# Altium schematic sheet GateDrivers.SchDoc
size C; SheetNumber: 2; SheetTotal: 4
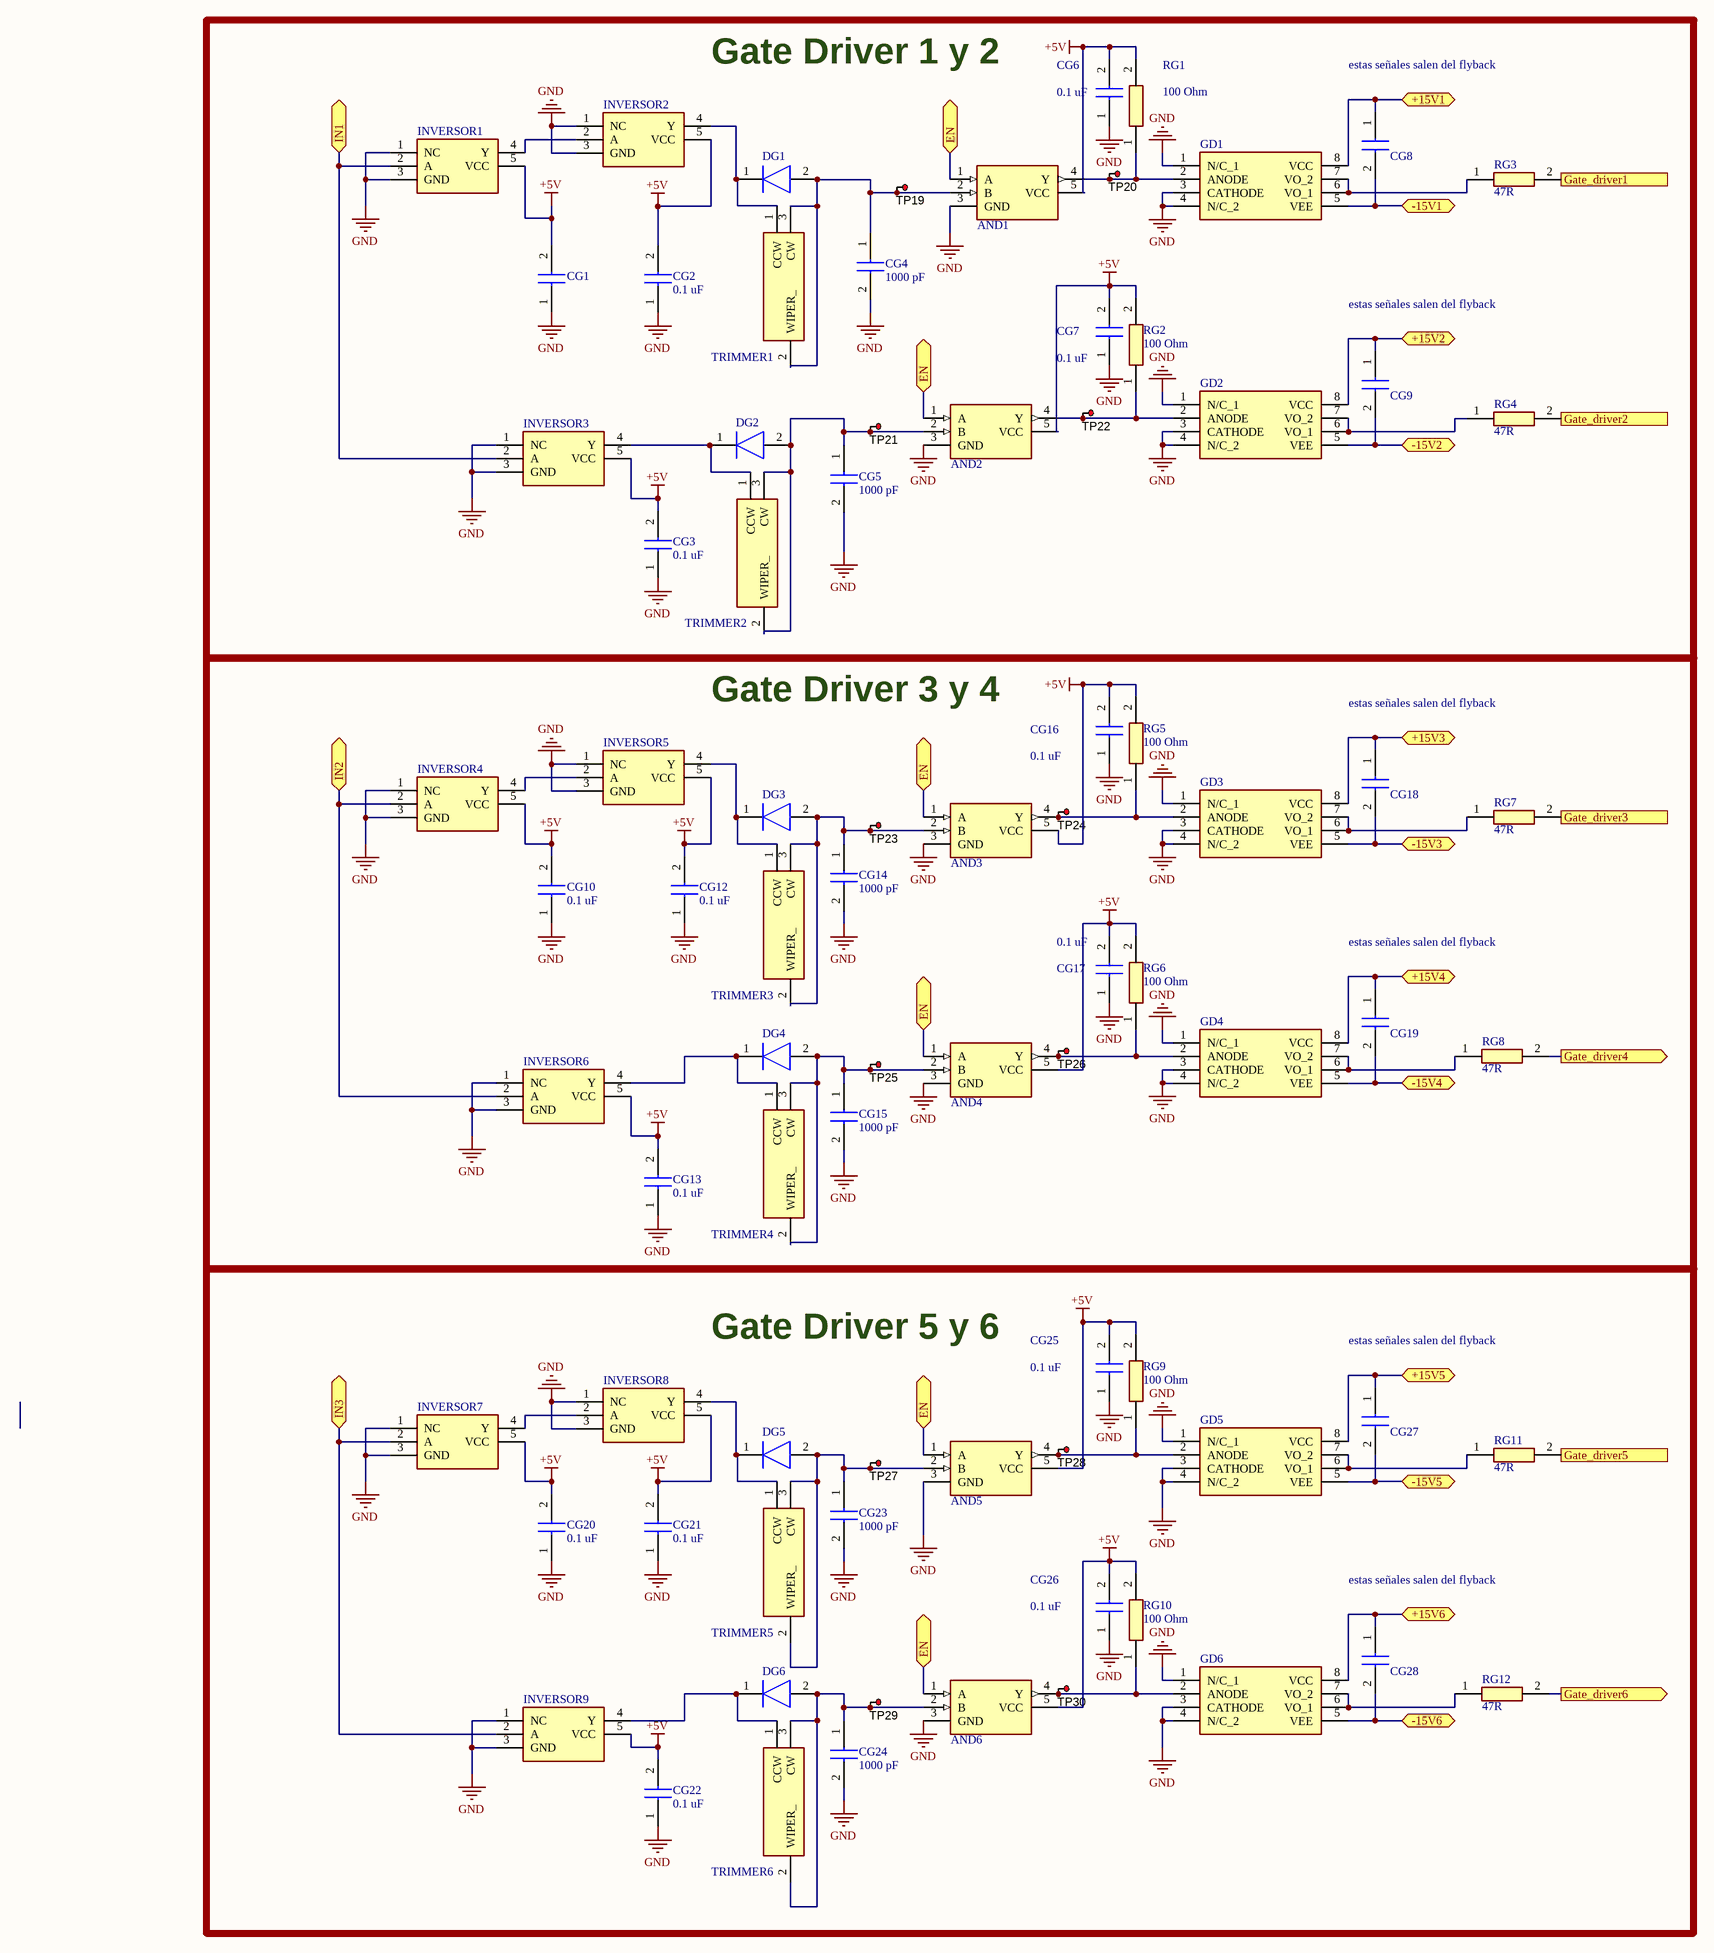
[diagram p0: GateDrivers.SchDoc]

## Parts
AND1  SN74AHC1G09DCKR  [SOT65P210X110-5N]  (value not drawn)
AND2  SN74AHC1G09DCKR  [SOT65P210X110-5N]  (value not drawn)
AND3  SN74AHC1G09DCKR  [SOT65P210X110-5N]  (value not drawn)
AND4  SN74AHC1G09DCKR  [SOT65P210X110-5N]  (value not drawn)
AND5  SN74AHC1G09DCKR  [SOT65P210X110-5N]  (value not drawn)
AND6  SN74AHC1G09DCKR  [SOT65P210X110-5N]  (value not drawn)
CG1  (no value)  [CAPC2012X94N]
CG2  0.1 uF  [CAPC2012X94N]
CG3  0.1 uF  [CAPC2012X94N]
CG4  1000 pF  [CAPC2012X98N]
CG5  1000 pF  [CAPC2012X98N]
CG6  0.1 uF  [CAPC2012X94N]
CG7  0.1 uF  [CAPC2012X94N]
CG8  CGA2B3X7R1V104M050BB_1  [CAPC1005X55N]  (value not drawn)
CG9  CGA2B3X7R1V104M050BB_1  [CAPC1005X55N]  (value not drawn)
CG10  0.1 uF  [CAPC2012X94N]
CG12  0.1 uF  [CAPC2012X94N]
CG13  0.1 uF  [CAPC2012X94N]
CG14  1000 pF  [CAPC2012X98N]
CG15  1000 pF  [CAPC2012X98N]
CG16  0.1 uF  [CAPC2012X94N]
CG17  0.1 uF  [CAPC2012X94N]
CG18  CGA2B3X7R1V104M050BB_1  [CAPC1005X55N]  (value not drawn)
CG19  CGA2B3X7R1V104M050BB_1  [CAPC1005X55N]  (value not drawn)
CG20  0.1 uF  [CAPC2012X94N]
CG21  0.1 uF  [CAPC2012X94N]
CG22  0.1 uF  [CAPC2012X94N]
CG23  1000 pF  [CAPC2012X98N]
CG24  1000 pF  [CAPC2012X98N]
CG25  0.1 uF  [CAPC2012X94N]
CG26  0.1 uF  [CAPC2012X94N]
CG27  CGA2B3X7R1V104M050BB_1  [CAPC1005X55N]  (value not drawn)
CG28  CGA2B3X7R1V104M050BB_1  [CAPC1005X55N]  (value not drawn)
DG1  BAS85-GS08  [BAQ33GS08]  (value not drawn)
DG2  BAS85-GS08  [BAQ33GS08]  (value not drawn)
DG3  BAS85-GS08  [BAQ33GS08]  (value not drawn)
DG4  BAS85-GS08  [BAQ33GS08]  (value not drawn)
DG5  BAS85-GS08  [BAQ33GS08]  (value not drawn)
DG6  BAS85-GS08  [BAQ33GS08]  (value not drawn)
GD1  HCPL-3120  [DIP762W65P254L965H470Q8N]  (value not drawn)
GD2  HCPL-3120  [DIP762W65P254L965H470Q8N]  (value not drawn)
GD3  HCPL-3120  [DIP762W65P254L965H470Q8N]  (value not drawn)
GD4  HCPL-3120  [DIP762W65P254L965H470Q8N]  (value not drawn)
GD5  HCPL-3120  [DIP762W65P254L965H470Q8N]  (value not drawn)
GD6  HCPL-3120  [DIP762W65P254L965H470Q8N]  (value not drawn)
INVERSOR1  SN74AHC1G14DRLR  [SOTFL50P160X60-5N]  (value not drawn)
INVERSOR2  SN74AHC1G14DRLR  [SOTFL50P160X60-5N]  (value not drawn)
INVERSOR3  SN74AHC1G14DRLR  [SOTFL50P160X60-5N]  (value not drawn)
INVERSOR4  SN74AHC1G14DRLR  [SOTFL50P160X60-5N]  (value not drawn)
INVERSOR5  SN74AHC1G14DRLR  [SOTFL50P160X60-5N]  (value not drawn)
INVERSOR6  SN74AHC1G14DRLR  [SOTFL50P160X60-5N]  (value not drawn)
INVERSOR7  SN74AHC1G14DRLR  [SOTFL50P160X60-5N]  (value not drawn)
INVERSOR8  SN74AHC1G14DRLR  [SOTFL50P160X60-5N]  (value not drawn)
INVERSOR9  SN74AHC1G14DRLR  [SOTFL50P160X60-5N]  (value not drawn)
RG1  100 Ohm  [RESC1608X55N]
RG2  100 Ohm  [RESC1608X55N]
RG3  Resistance: 47R  [RESC3246X60N]  (hidden comment: RCL121847R0JNEK_1)
RG4  Resistance: 47R  [RESC3246X60N]  (hidden comment: RCL121847R0JNEK_1)
RG5  100 Ohm  [RESC1608X55N]
RG6  100 Ohm  [RESC1608X55N]
RG7  Resistance: 47R  [RESC3246X60N]  (hidden comment: RCL121847R0JNEK_1)
RG8  Resistance: 47R  [RESC3246X60N]  (hidden comment: RCL121847R0JNEK_1)
RG9  100 Ohm  [RESC1608X55N]
RG10  100 Ohm  [RESC1608X55N]
RG11  Resistance: 47R  [RESC3246X60N]  (hidden comment: RCL121847R0JNEK_1)
RG12  Resistance: 47R  [RESC3246X60N]  (hidden comment: RCL121847R0JNEK_1)
TP19  5010  [Keystone5010]  (value not drawn)
TP20  5010  [Keystone5010]  (value not drawn)
TP21  5010  [Keystone5010]  (value not drawn)
TP22  5010  [Keystone5010]  (value not drawn)
TP23  5010  [Keystone5010]  (value not drawn)
TP24  5010  [Keystone5010]  (value not drawn)
TP25  5010  [Keystone5010]  (value not drawn)
TP26  5010  [Keystone5010]  (value not drawn)
TP27  5010  [Keystone5010]  (value not drawn)
TP28  5010  [Keystone5010]  (value not drawn)
TP29  5010  [Keystone5010]  (value not drawn)
TP30  5010  [Keystone5010]  (value not drawn)
TRIMMER1  ST-4ETB203  [ST4ETB203]  (value not drawn)
TRIMMER2  ST-4ETB203  [ST4ETB203]  (value not drawn)
TRIMMER3  ST-4ETB203  [ST4ETB203]  (value not drawn)
TRIMMER4  ST-4ETB203  [ST4ETB203]  (value not drawn)
TRIMMER5  ST-4ETB203  [ST4ETB203]  (value not drawn)
TRIMMER6  ST-4ETB203  [ST4ETB203]  (value not drawn)

## Blocks framed on the sheet
Gate Driver 1 y 2: AND1 AND2 CG1-CG9 DG1 DG2 GD1 GD2 INVERSOR1-INVERSOR3 RG1-RG4 TP19-TP22 TRIMMER1 TRIMMER2
Gate Driver 3 y 4: AND3 AND4 CG10 CG12-CG19 DG3 DG4 GD3 GD4 INVERSOR4-INVERSOR6 RG5-RG8 TP23-TP26 TRIMMER3 TRIMMER4
Gate Driver 5 y 6: AND5 AND6 CG20-CG28 DG5 DG6 GD5 GD6 INVERSOR7-INVERSOR9 RG9-RG12 TP27-TP30 TRIMMER5 TRIMMER6

## Ports
+15V1 (bidir), +15V2 (bidir), +15V3 (bidir), +15V4 (bidir), +15V5 (bidir), +15V6 (bidir), -15V1 (bidir), -15V2 (bidir), -15V3 (bidir), -15V4 (bidir), -15V5 (bidir), -15V6 (bidir), EN (bidir), Gate_driver1 (out), Gate_driver2 (out), Gate_driver3 (out), Gate_driver4 (out), Gate_driver5 (out), Gate_driver6 (out), IN1 (bidir), IN2 (bidir), IN3 (bidir)

## Nets
+5V: AND1.5(VCC) AND2.5(VCC) AND3.5(VCC) AND4.5(VCC) AND5.5(VCC) AND6.5(VCC) CG1.2 CG2.2 CG3.2 CG6.2 CG7.2 CG10.2 CG12.2 CG13.2 CG16.2 CG17.2 CG20.2 CG21.2 CG22.2 CG25.2 CG26.2 INVERSOR1.5(VCC) INVERSOR2.5(VCC) INVERSOR3.5(VCC) INVERSOR4.5(VCC) INVERSOR5.5(VCC) INVERSOR6.5(VCC) INVERSOR7.5(VCC) INVERSOR8.5(VCC) INVERSOR9.5(VCC) RG1.2 RG2.2 RG5.2 RG6.2 RG9.2 RG10.2
GND: AND1.3(GND) AND2.3(GND) AND3.3(GND) AND4.3(GND) AND5.3(GND) AND6.3(GND) CG1.1 CG2.1 CG3.1 CG4.2 CG5.2 CG6.1 CG7.1 CG10.1 CG12.1 CG13.1 CG14.2 CG15.2 CG16.1 CG17.1 CG20.1 CG21.1 CG22.1 CG23.2 CG24.2 CG25.1 CG26.1 GD1.1(N/C_1) GD1.3(CATHODE) GD1.4(N/C_2) GD2.1(N/C_1) GD2.3(CATHODE) GD2.4(N/C_2) GD3.1(N/C_1) GD3.3(CATHODE) GD3.4(N/C_2) GD4.1(N/C_1) GD4.3(CATHODE) GD4.4(N/C_2) GD5.1(N/C_1) GD5.3(CATHODE) GD5.4(N/C_2) GD6.1(N/C_1) GD6.3(CATHODE) GD6.4(N/C_2) INVERSOR1.1(NC) INVERSOR1.3(GND) INVERSOR2.1(NC) INVERSOR2.3(GND) INVERSOR3.1(NC) INVERSOR3.3(GND) INVERSOR4.1(NC) INVERSOR4.3(GND) INVERSOR5.1(NC) INVERSOR5.3(GND) INVERSOR6.1(NC) INVERSOR6.3(GND) INVERSOR7.1(NC) INVERSOR7.3(GND) INVERSOR8.1(NC) INVERSOR8.3(GND) INVERSOR9.1(NC) INVERSOR9.3(GND)
+15V1: CG8.1 GD1.8(VCC) ; port +15V1
+15V2: CG9.1 GD2.8(VCC) ; port +15V2
+15V3: CG18.1 GD3.8(VCC) ; port +15V3
+15V4: CG19.1 GD4.8(VCC) ; port +15V4
+15V5: CG27.1 GD5.8(VCC) ; port +15V5
+15V6: CG28.1 GD6.8(VCC) ; port +15V6
-15V1: CG8.2 GD1.5(VEE) ; port -15V1
-15V2: CG9.2 GD2.5(VEE) ; port -15V2
-15V3: CG18.2 GD3.5(VEE) ; port -15V3
-15V4: CG19.2 GD4.5(VEE) ; port -15V4
-15V5: CG27.2 GD5.5(VEE) ; port -15V5
-15V6: CG28.2 GD6.5(VEE) ; port -15V6
EN: AND1.1(A) AND2.1(A) AND3.1(A) AND4.1(A) AND5.1(A) AND6.1(A) ; port EN
Gate_driver1: RG3.2 ; port Gate_driver1
Gate_driver2: RG4.2 ; port Gate_driver2
Gate_driver3: RG7.2 ; port Gate_driver3
Gate_driver4: RG8.2 ; port Gate_driver4
Gate_driver5: RG11.2 ; port Gate_driver5
Gate_driver6: RG12.2 ; port Gate_driver6
IN1: INVERSOR1.2(A) INVERSOR3.2(A) ; port IN1
IN2: INVERSOR4.2(A) INVERSOR6.2(A) ; port IN2
IN3: INVERSOR7.2(A) INVERSOR9.2(A) ; port IN3
NetAND1_2: AND1.2(B) CG4.1 DG1.2(A) TP19.1 TRIMMER1.2(WIPER_) TRIMMER1.3(CW)
NetAND1_4: AND1.4(Y) GD1.2(ANODE) RG1.1 TP20.1
NetAND2_2: AND2.2(B) CG5.1 DG2.2(A) TP21.1 TRIMMER2.2(WIPER_) TRIMMER2.3(CW)
NetAND2_4: AND2.4(Y) GD2.2(ANODE) RG2.1 TP22.1
NetAND3_2: AND3.2(B) CG14.1 DG3.2(A) TP23.1 TRIMMER3.2(WIPER_) TRIMMER3.3(CW)
NetAND3_4: AND3.4(Y) GD3.2(ANODE) RG5.1 TP24.1
NetAND4_2: AND4.2(B) CG15.1 DG4.2(A) TP25.1 TRIMMER4.2(WIPER_) TRIMMER4.3(CW)
NetAND4_4: AND4.4(Y) GD4.2(ANODE) RG6.1 TP26.1
NetAND5_2: AND5.2(B) CG23.1 DG5.2(A) TP27.1 TRIMMER5.2(WIPER_) TRIMMER5.3(CW)
NetAND5_4: AND5.4(Y) GD5.2(ANODE) RG9.1 TP28.1
NetAND6_2: AND6.2(B) CG24.1 DG6.2(A) TP29.1 TRIMMER6.2(WIPER_) TRIMMER6.3(CW)
NetAND6_4: AND6.4(Y) GD6.2(ANODE) RG10.1 TP30.1
NetDG1_1: DG1.1(K) INVERSOR2.4(Y) TRIMMER1.1(CCW)
NetDG2_1: DG2.1(K) INVERSOR3.4(Y) TRIMMER2.1(CCW)
NetDG3_1: DG3.1(K) INVERSOR5.4(Y) TRIMMER3.1(CCW)
NetDG4_1: DG4.1(K) INVERSOR6.4(Y) TRIMMER4.1(CCW)
NetDG5_1: DG5.1(K) INVERSOR8.4(Y) TRIMMER5.1(CCW)
NetDG6_1: DG6.1(K) INVERSOR9.4(Y) TRIMMER6.1(CCW)
NetGD1_6: GD1.6(VO_1) GD1.7(VO_2) RG3.1
NetGD2_6: GD2.6(VO_1) GD2.7(VO_2) RG4.1
NetGD3_6: GD3.6(VO_1) GD3.7(VO_2) RG7.1
NetGD4_6: GD4.6(VO_1) GD4.7(VO_2) RG8.1
NetGD5_6: GD5.6(VO_1) GD5.7(VO_2) RG11.1
NetGD6_6: GD6.6(VO_1) GD6.7(VO_2) RG12.1
NetINVERSOR1_4: INVERSOR1.4(Y) INVERSOR2.2(A)
NetINVERSOR4_4: INVERSOR4.4(Y) INVERSOR5.2(A)
NetINVERSOR7_4: INVERSOR7.4(Y) INVERSOR8.2(A)

## Notes on the sheet
- estas señales salen del flyback

## Library data of the parts
AND1-AND6 = SN74AHC1G09DCKR: TEXAS INSTRUMENTS         SN74AHC1G09DCKR             AND Gate, ACH Family, 2 Input, 1 Gate, 25 mA, 2V to 5.5V, SC-70-5; Quiescent Current: 1uA; Output Current: 25mA; Number of Inputs: 2; Propagation Delay: 7.5ns; Number of Outputs: 1; Low Level Output Current: 8mA; Datasheet Link: http://www.ti.com/lit/gpn/sn74ahc1g09; Height: 1.1mm; Manufacturer_Name: Texas Instruments; Manufacturer_Part_Number: SN74AHC1G09DCKR; Supplier 1: Digi-Key; Manufacturer: Texas Instruments; Manufacturer Part Number: SN74AHC1G09DCKR; RoHS: Yes; Category: Logic Gates; Stock 1: 19244; Pricing 1: 1=0.40000, 10=0.29700, 25=0.25960, 100=0.16810, 250=0.13912, 500=0.11130, 1000=0.08533 (USD); Mount: Surface Mount; Case/Package: SC; Number of Pins: 5; Min Operating Temperature: -55°C; Max Operating Temperature: 125°C; Max Supply Voltage: 5.5V; Min Supply Voltage: 2V; Logic Function: AND GATE; Packaging: Tape and Reel; Package Quantity: 3000; Output Voltage: 5.5V; Number of Circuits: 1; Number of Gates: 1; Number of Elements: 1; Number of Bits: 1; Series: 74AHC; Technology: CMOS; Radiation Hardening: No; REACH SVHC: No SVHC; Lead Free: Lead Free; RoHS Compliant: Yes; ComponentLink1URL: https://datasheet.ciiva.com/1869/sn74ahc1g09-1869442.pdf?src-supplier=Digi-Key; ComponentLink1Description: https://datasheet.ciiva.com/1869/sn74ahc1g09-1869442.pdf?src-supplier=Digi-Key; ComponentLink2URL: https://datasheet.ciiva.com/4817/scls724b-115396-4817364.pdf?src-supplier=Mouser; ComponentLink2Description: https://datasheet.ciiva.com/4817/scls724b-115396-4817364.pdf?src-supplier=Mouser; ComponentLink3URL: https://datasheet.ciiva.com/1869/sn74ahc1g09-1869443.pdf?src-supplier=Digi-Key; ComponentLink3Description: https://datasheet.ciiva.com/1869/sn74ahc1g09-1869443.pdf?src-supplier=Digi-Key; ComponentLink4URL: https://datasheet.ciiva.com/1869/sn74ahc1g09-1869444.pdf?src-supplier=Digi-Key; ComponentLink4Description: https://datasheet.ciiva.com/1869/sn74ahc1g09-1869444.pdf?src-supplier=Digi-Key; ComponentLink5URL: https://datasheet.ciiva.com/14310/sn74ahc1g09-14310535.pdf?src-supplier=Avnet; ComponentLink5Description: https://datasheet.ciiva.com/14310/sn74ahc1g09-14310535.pdf?src-supplier=Avnet; ComponentLink6URL: https://datasheet.ciiva.com/41677/1864448-41677365.pdf?src-supplier=Newark; ComponentLink6Description: https://datasheet.ciiva.com/41677/1864448-41677365.pdf?src-supplier=Newark; Supplier Part Number 1: 296-29203-1-ND
CG1-CG3 CG6 CG7 CG10 CG12 CG13 CG16 CG17 CG20-CG22 CG25 CG26 = 0805YC104KAT2A: Multilayer Ceramic Capacitors MLCC - SMD/SMT 16V .1uF X7R 0805 10%; Manufacturer_Name: AVX; Manufacturer: Kyocera AVX; Capacitance: 100nF; Dissipation Factor: 12.5%; Insulation Resistance: 100GR; Datasheet Link: https://spicat.avx.com/product/mlcc/chartview/0805YC104KAT2A/DataSheet/X7R; Height: 0.94mm; Manufacturer_Part_Number: 0805YC104KAT2A; Mouser Part Number: 581-0805YC104K; Mouser Price/Stock: https://www.mouser.co.uk/ProductDetail/AVX/0805YC104KAT2A?qs=0j3vzYx9OgS3bRufCc82qg%3D%3D; Arrow Part Number: 0805YC104KAT2A; Arrow Price/Stock: https://www.arrow.com/en/products/0805yc104kat2a/avx; Supplier 1: Digi-Key; Manufacturer Part Number: 0805YC104KAT2A; RoHS: Yes; Category: Ceramic Capacitors; Stock 1: 61419; Pricing 1: 1=0.30000, 10=0.20700, 50=0.12420, 100=0.10490, 500=0.07176, 1000=0.06348 (USD); Mount: Surface Mount; Case/Package: 0805; Number of Pins: 2; Case Code (Metric): 2012; Case Code (Imperial): 0805; Min Operating Temperature: -55°C; Max Operating Temperature: 125°C; Tolerance: 10%; Dielectric: X7R; Packaging: Tape and Reel; Voltage Rating: 16V; Package Quantity: 1; Termination: SMD/SMT; Voltage Rating (DC): 16V; Series: -; Construction: Flat; Length: 2.01mm; Width: 0.049inch; Depth: 1.25mm; Thickness: 0.037inch; Radiation Hardening: No; REACH SVHC: No SVHC; Lead Free: Lead Free; RoHS Compliant: Yes; ComponentLink1URL: https://datasheet.ciiva.com/206/cx7r-206011.pdf?src-supplier=Digi-Key; ComponentLink1Description: https://datasheet.ciiva.com/206/cx7r-206011.pdf?src-supplier=Digi-Key; ComponentLink2URL: https://datasheet.ciiva.com/5418/cx7r-5418479.pdf?src-supplier=Mouser; ComponentLink2Description: https://datasheet.ciiva.com/5418/cx7r-5418479.pdf?src-supplier=Mouser; ComponentLink3URL: https://datasheet.ciiva.com/2988/cx7r-2988050.pdf?src-supplier=Avnet; ComponentLink3Description: https://datasheet.ciiva.com/2988/cx7r-2988050.pdf?src-supplier=Avnet; ComponentLink4URL: https://datasheet.ciiva.com/14906/cx7r-14906278.pdf?src-supplier=Digi-Key; ComponentLink4Description: https://datasheet.ciiva.com/14906/cx7r-14906278.pdf?src-supplier=Digi-Key; ComponentLink5URL: https://datasheet.ciiva.com/15212/getdatasheetpartid-150472-15212621.pdf?src-supplier=Verical; ComponentLink5Description: https://datasheet.ciiva.com/15212/getdatasheetpartid-150472-15212621.pdf?src-supplier=Verical; ComponentLink6URL: https://datasheet.ciiva.com/28613/1679506-28613143.pdf?src-supplier=Element14; ComponentLink6Description: https://datasheet.ciiva.com/28613/1679506-28613143.pdf?src-supplier=Element14; ComponentLink7URL: https://datasheet.ciiva.com/16623/cx7r-16623414.pdf?src-supplier=Avnet+Europe; ComponentLink7Description: https://datasheet.ciiva.com/16623/cx7r-16623414.pdf?src-supplier=Avnet+Europe; Supplier Part Number 1: 478-7961-1-ND
CG4 CG5 CG14 CG15 CG23 CG24 = C0805Y102K3RACTU: Multilayer Ceramic Capacitors MLCC - SMD/SMT 25volts 1000pF 10% X7R; Manufacturer_Name: Kemet; Capacitance: 1nF; Voltage Rating (DC): 25V; Datasheet Link: https://www.kemet.com/specsheet/C0805Y102K3RACTU; Height: 0.98mm; Manufacturer_Part_Number: C0805Y102K3RACTU; Mouser Part Number: 80-C0805Y102K3R; Mouser Price/Stock: https://www.mouser.com/Search/Refine.aspx?Keyword=80-C0805Y102K3R; Manufacturer: KEMET; Manufacturer Part Number: C0805Y102K3RACTU; RoHS: Yes; Category: Capacitors; Stock 1: 8015; Pricing 1: 1=0.43000, 10=0.30100, 50=0.30100, 100=0.18100, 1000=0.11400, 10000=0.10200 (USD); Case/Package: 0805; Case Code (Imperial): 0805; Case Code (Metric): 2012; Weight: 0.000194oz; Dielectric Material: Ceramic; Min Operating Temperature: -55°C; Max Operating Temperature: 125°C; Packaging: Tape and Reel; Tolerance: 10%; Dielectric: X7R; Termination: SMD/SMT; Series: C0805Y; RoHS Compliant: Yes; ComponentLink1URL: http://www.mouser.com/ds/2/212/KEM_C1015_X7R_FF-CAP_SMD-1101148.pdf?src-supplier=Mouser; ComponentLink1Description: http://www.mouser.com/ds/2/212/KEM_C1015_X7R_FF-CAP_SMD-1101148.pdf?src-supplier=Mouser
  CG4 CG14 CG23: Supplier 1: Digi-Key; Supplier Part Number 1: 399-15433-1-ND
  CG5 CG15 CG24: Supplier 1: Mouser; Supplier Part Number 1: 80-C0805Y102K3R
CG8 CG9 CG18 CG19 CG27 CG28 = CGA2B3X7R1V104M050BB_1: Cap Ceramic 0.1uF 35V X7R 20% Pad SMD 0402 125C Automotive T/R; Manufacturer_Name: TDK; Capacitance: 100nF; Height: 0.55mm; Manufacturer_Part_Number: CGA2B3X7R1V104M050BB; Supplier 1: Digi-Key; Manufacturer: TDK; Manufacturer Part Number: CGA2B3X7R1V104M050BB; RoHS: Yes; Category: Ceramic Capacitors; Stock 1: 93877; Pricing 1: 1=0.14000, 10=0.10200, 50=0.05780, 100=0.04780, 500=0.03356, 1000=0.02778, 2500=0.02585, 5000=0.02365 (USD); Mount: Surface Mount; Case/Package: 0402; Case Code (Metric): 1005; Case Code (Imperial): 0402; Min Operating Temperature: -55°C; Max Operating Temperature: 125°C; Tolerance: 20%; Dielectric: X7R; Packaging: Tape and Reel; Voltage Rating: 35V; Package Quantity: 10000; Voltage Rating (DC): 35V; Series: CGA; Length: 0.039inch; Width: 0.02inch; Thickness: 0.022inch; RoHS Compliant: Yes; ComponentLink1URL: http://www.mouser.com/ds/2/400/lcc_automotive_general_en-843974.pdf?src-supplier=Mouser; ComponentLink1Description: http://www.mouser.com/ds/2/400/lcc_automotive_general_en-843974.pdf?src-supplier=Mouser; ComponentLink2URL: https://product.tdk.com/info/en/catalog/datasheets/mlcc_automotive_general_en.pdf?src-supplier=Digi-Key; ComponentLink2Description: https://product.tdk.com/info/en/catalog/datasheets/mlcc_automotive_general_en.pdf?src-supplier=Digi-Key; ComponentLink3URL: https://product.tdk.com/info/en/documents/chara_sheet/CGA2B3X7R1V104M050BB.pdf?src-supplier=Digi-Key; ComponentLink3Description: https://product.tdk.com/info/en/documents/chara_sheet/CGA2B3X7R1V104M050BB.pdf?src-supplier=Digi-Key; ComponentLink4URL: http://product.tdk.com/en/catalog/datasheets/mlcc_automotive_general_en.pdf?src-supplier=Avnet; ComponentLink4Description: http://product.tdk.com/en/catalog/datasheets/mlcc_automotive_general_en.pdf?src-supplier=Avnet; Supplier Part Number 1: 445-12264-1-ND; Weight: 2.3E-05oz; Ratings: AEC-Q200
DG1-DG6 = BAS85-GS08: VISHAY - BAS85-GS08 - Small Signal Schottky Diode, Single, 30 V, 200 mA, 800 mV, 600 mA, 125 °C; Manufacturer: Vishay Semiconductors; Recovery Time: 5ns; Max Surge Current: 600mA; Forward Voltage: 800mV; Forward Current: 200mA; Max Reverse Current: 2uA; Max Repetitive Reverse Voltage (Vrrm): 30V; Power Dissipation: 200mW; Current Rating: 200A; Datasheet Link: https://www.vishay.com/docs/85510/bas85.pdf; Height: 1.6mm; Manufacturer_Name: Vishay; Manufacturer_Part_Number: BAS85-GS08; Supplier 1: Allied Electronics; Manufacturer Part Number: BAS85-GS08; RoHS: Yes; Category: Rectifier Diodes; Stock 1: 12500; Pricing 1: 1=0.06300, 12500=0.06000, 625000=0.05900 (USD); Mount: Surface Mount; Number of Pins: 2; Contact Plating: Tin,Silver; Min Operating Temperature: -55°C; Max Operating Temperature: 125°C; Package Quantity: 1; Packaging: Tape and Reel; Average Rectified Current: 200mA; Reverse Recovery Time: 5ns; Max Reverse Leakage Current: 2uA; Peak Non-Repetitive Surge Current: 600mA; Max Forward Surge Current (Ifsm): 600mA; Element Configuration: Single; Current: 200mA; Voltage: 30V; Max Reverse Voltage (DC): 30V; Diameter: 1.6mm; Length: 0.145inch; Width: 1.6mm; Radiation Hardening: No; REACH SVHC: Unknown; Lead Free: Lead Free; RoHS Compliant: Yes; ComponentLink1URL: https://datasheet.ciiva.com/1202/1354484-1202985.pdf?src-supplier=Farnell; ComponentLink1Description: https://datasheet.ciiva.com/1202/1354484-1202985.pdf?src-supplier=Farnell; ComponentLink2URL: https://datasheet.ciiva.com/4715/bas85-88986-4715157.pdf?src-supplier=Mouser; ComponentLink2Description: https://datasheet.ciiva.com/4715/bas85-88986-4715157.pdf?src-supplier=Mouser; ComponentLink3URL: https://datasheet.ciiva.com/17069/0900766b80de2cb8-17069417.pdf?src-supplier=Allied+Electronics; ComponentLink3Description: https://datasheet.ciiva.com/17069/0900766b80de2cb8-17069417.pdf?src-supplier=Allied+Electronics; ComponentLink4URL: https://datasheet.ciiva.com/1240/1749352-1240576.pdf?src-supplier=Newark; ComponentLink4Description: https://datasheet.ciiva.com/1240/1749352-1240576.pdf?src-supplier=Newark; ComponentLink5URL: https://datasheet.ciiva.com/13950/bas85-13950054.pdf?src-supplier=Digi-Key; ComponentLink5Description: https://datasheet.ciiva.com/13950/bas85-13950054.pdf?src-supplier=Digi-Key; ComponentLink6URL: https://datasheet.ciiva.com/13950/bas85-13950058.pdf?src-supplier=Digi-Key; ComponentLink6Description: https://datasheet.ciiva.com/13950/bas85-13950058.pdf?src-supplier=Digi-Key; ComponentLink7URL: https://datasheet.ciiva.com/8281/bas85-8281903.pdf?src-supplier=Avnet; ComponentLink7Description: https://datasheet.ciiva.com/8281/bas85-8281903.pdf?src-supplier=Avnet; ComponentLink8URL: https://datasheet.ciiva.com/16298/bas85-16298175.pdf?src-supplier=Future+Electronics; ComponentLink8Description: https://datasheet.ciiva.com/16298/bas85-16298175.pdf?src-supplier=Future+Electronics; ComponentLink9URL: https://datasheet.ciiva.com/16941/70061833-16941564.pdf?src-supplier=Allied+Electronics; ComponentLink9Description: https://datasheet.ciiva.com/16941/70061833-16941564.pdf?src-supplier=Allied+Electronics; ComponentLink10URL: https://datasheet.ciiva.com/25936/bas85-25936302.pdf?src-supplier=Avnet+Europe; ComponentLink10Description: https://datasheet.ciiva.com/25936/bas85-25936302.pdf?src-supplier=Avnet+Europe; Supplier Part Number 1: 70062025
GD1-GD6 = HCPL-3120: Optocoupler Drive Push-Pull 1-CH 30V 1500V 8-Pin PDIP; Manufacturer_Name: Avago Technologies; Manufacturer: Broadcom Avago; Number of Channels: 1; Propagation Delay: 500ns; Rise Time: 100ns; Pulse Width Distortion (PWD): 300ns; Direction: Unidirectional; Max Power Dissipation: 295mW; Forward Current: 25mA; Forward Voltage: 1.5V; Reverse Breakdown Voltage: 5V; High Level Output Current: 2A; Fall Time: 0.1us; Isolation Voltage: 3.75kV; Max Output Current: 2.5A; Input Type: DC; Approvals: CSA,UR; Datasheet Link: https://docs.broadcom.com/docs/AV02-0161EN; Height: 4.7mm; Mouser2 Part Number: 630-HCPL-3120; Mouser2 Price/Stock: https://www.mouser.com/Search/Refine.aspx?Keyword=630-HCPL-3120; Manufacturer_Part_Number: HCPL-3120; Supplier 1: Digi-Key; Manufacturer Part Number: HCPL-3120; RoHS: No; Category: Optocouplers; Stock 1: 3108; Pricing 1: 1=4.42000, 10=3.12300, 100=2.55790, 500=2.15642, 1000=2.10450 (USD); Mount: Through Hole; Case/Package: PDIP; Number of Pins: 8; Min Operating Temperature: -40°C; Max Operating Temperature: 100°C; Packaging: Rail/Tube; Package Quantity: 50; Series: -; Low Level Output Current: 2A; Turn-On Delay Time: 500ns; Number of Elements: 1; Power Dissipation: 295mW; Output Type: PUSH-PULL; Radiation Hardening: No; RoHS Compliant: No; Lead Free: Contains Lead; ComponentLink1URL: https://datasheet.ciiva.com/19453/1550434-19453924.pdf?src-supplier=Jameco; ComponentLink1Description: https://datasheet.ciiva.com/19453/1550434-19453924.pdf?src-supplier=Jameco; ComponentLink2URL: https://datasheet.ciiva.com/15119/getdatasheetpartid-141584-15119757.pdf?src-supplier=Verical; ComponentLink2Description: https://datasheet.ciiva.com/15119/getdatasheetpartid-141584-15119757.pdf?src-supplier=Verical; Supplier Part Number 1: 516-1121-5-ND
INVERSOR1-INVERSOR9 = SN74AHC1G14DRLR: IC INVERTER SCHMITT 1CH SOT5; Manufacturer_Name: Texas Instruments; Number of Inputs: 1; Propagation Delay: 10.6ns; Max Supply Voltage: 5.5V; Min Supply Voltage: 2V; Logic Function: Inverting,Schmitt Trigger,Inverter; Quiescent Current: 1uA; High Level Output Current: -8mA; Low Level Output Current: 8mA; Turn-On Delay Time: 18.5ns; Input Type: SCHMITT TRIGGER; Operating Supply Voltage: 5V; Datasheet Link: http://www.ti.com/lit/gpn/sn74ahc1g14; Height: 0.6mm; Mouser2 Part Number: 595-SN74AHC1G14DRLR; Mouser2 Price/Stock: https://www.mouser.com/Search/Refine.aspx?Keyword=595-SN74AHC1G14DRLR; Manufacturer_Part_Number: SN74AHC1G14DRLR; Supplier 1: Digi-Key; Manufacturer: Texas Instruments; Manufacturer Part Number: SN74AHC1G14DRLR; RoHS: Yes; Category: Logic Gates; Stock 1: 2029; Pricing 1: 1=0.51000, 10=0.41400, 25=0.37840, 100=0.28150, 250=0.25516, 500=0.21116, 1000=0.15836 (USD); Mount: Surface Mount; Case/Package: SOT-553; Number of Pins: 5; Weight: 9.9E-05oz; Min Operating Temperature: -40°C; Max Operating Temperature: 125°C; Package Quantity: 4000; Packaging: Cut Tape; Number of Elements: 1; Number of Circuits: 1; Number of Gates: 1; Number of Bits: 1; Series: SN74AHC1G14; Radiation Hardening: No; Lead Free: Lead Free; RoHS Compliant: Yes; ComponentLink1URL: https://datasheet.ciiva.com/1866/sn74ahc1g14-1866325.pdf?src-supplier=Digi-Key; ComponentLink1Description: https://datasheet.ciiva.com/1866/sn74ahc1g14-1866325.pdf?src-supplier=Digi-Key; Supplier Part Number 1: 296-23232-1-ND
RG1 RG2 RG5 RG6 RG9 RG10 = RC0603JR-13100RL: YAGEO - RC0603JR-13100RL - RES, THICK FILM, 100R, 5%, 0.1W, 0603; Manufacturer_Name: YAGEO (PHYCOMP); Resistance: 47; Power Rating: 100mW; Voltage Rating: 50V; Temperature Coefficient: 100ppm/°C; Datasheet Link: http://www.yageo.com/documents/recent/PYu-RC0603_51_RoHS_L_v5.pdf; Height: 0.55mm; Manufacturer_Part_Number: RC0603JR-13100RL; Supplier 1: Digi-Key; Manufacturer: Yageo; Manufacturer Part Number: RC0603JR-13100RL; RoHS: Yes; Category: Chip SMD Resistors; Stock 1: 37865; Pricing 1: 1=0.10000, 10=0.02000, 100=0.00800, 1000=0.00360, 2500=0.00312, 5000=0.00258 (USD); Case/Package: 0603; Number of Pins: 2; Case Code (Imperial): 0603; Case Code (Metric): 1608; Min Operating Temperature: -55°C; Max Operating Temperature: 155°C; Tolerance: 5%; Packaging: Tape and Reel; Resistor Type: Thick Film; Termination: SMD/SMT; Voltage Rating (DC): 50V; Series: RC; Construction: Rectangular; Resistance Tolerance: 5%; Length: 1.6mm; Width: 0.8mm; Depth: 0.8mm; REACH SVHC: No SVHC; Military Standard: Not; Lead Free: Lead Free; RoHS Compliant: Yes; ComponentLink1URL: https://datasheet.ciiva.com/12558/rc0603-272842-12558903.pdf?src-supplier=Mouser; ComponentLink1Description: https://datasheet.ciiva.com/12558/rc0603-272842-12558903.pdf?src-supplier=Mouser; ComponentLink2URL: https://datasheet.ciiva.com/7983/443971-7983750.pdf?src-supplier=Element14; ComponentLink2Description: https://datasheet.ciiva.com/7983/443971-7983750.pdf?src-supplier=Element14; Supplier Part Number 1: 13-RC0603JR-13100RLCT-ND
RG3 RG4 RG7 RG8 RG11 RG12 = RCL121847R0JNEK_1: Res Thick Film 1218 47 Ohm 5% 1W ±200ppm/C Pad SMD Automotive T/R; Manufacturer_Name: Vishay; Voltage Rating: 200V; Temperature Coefficient: 200ppm/°C; Datasheet Link: http://www.vishay.com/docs/20046/rcle3.pdf; Height: 0.6mm; Manufacturer_Part_Number: RCL121847R0JNEK; Supplier 1: Digi-Key; Manufacturer: Vishay; Manufacturer Part Number: RCL121847R0JNEK; RoHS: Yes; Category: Chip SMD Resistors; Stock 1: 6113; Pricing 1: 1=0.62000, 10=0.47600, 100=0.20010, 1000=0.11040 (USD); Case/Package: 1218; Case Code (Metric): 4532; Case Code (Imperial): 1812; Weight: 0.001041oz; Min Operating Temperature: -55°C; Max Operating Temperature: 155°C; Package Quantity: 4000; Power Rating: 1W; Tolerance: 5%; Packaging: Tape and Reel; Resistor Type: Thick Film; Number of Terminations: 2; Termination: SMD/SMT; Max Power Dissipation: 1W; Features: Automotive AEC-Q200; Series: RCL; Length: 0.126inch; Width: 0.181inch; Height - Seated (Max): 0.024inch; RoHS Compliant: Yes; ComponentLink1URL: https://datasheet.ciiva.com/2480/dcrcwe3-2480270.pdf?src-supplier=Digi-Key; ComponentLink1Description: https://datasheet.ciiva.com/2480/dcrcwe3-2480270.pdf?src-supplier=Digi-Key; ComponentLink2URL: https://datasheet.ciiva.com/2480/rcle3-2480271.pdf?src-supplier=Digi-Key; ComponentLink2Description: https://datasheet.ciiva.com/2480/rcle3-2480271.pdf?src-supplier=Digi-Key; ComponentLink3URL: https://datasheet.ciiva.com/2480/rcle3-2480272.pdf?src-supplier=Digi-Key; ComponentLink3Description: https://datasheet.ciiva.com/2480/rcle3-2480272.pdf?src-supplier=Digi-Key; Supplier Part Number 1: RCL47BCT-ND
TP19-TP30 = 5010: Test Point, Multipurpose, Red, TH; Manufacturer: Keystone; CompType: Test Point Loop; ContactFinish: Silver; SymbolVersion: 2008-04-04; PartNumber: 5010; PackageReference: Red Multipurpose Testpoint; RoHS: Y; MountType: TH; ComponentLink1Description: Datasheet URL; ComponentLink1URL: http://www.keyelco.com/userAssets/file/M60-2p60.pdf; Color: Red; Publisher: Texas Instruments; LatestRevisionDate: 2016-02-11; Supplier 1: Digi-Key; Supplier Part Number 1: 36-5010-ND; Supplier 2: Mouser; Supplier Part Number 2: 534-5010
TRIMMER1-TRIMMER6 = ST-4ETB203: TRIMMER 20K OHM 0.25W SMD; Manufacturer_Name: NIDEC COPAL; Resistance: 20kR; Tolerance: 20%; Number of Turns: 1; Max Power Dissipation: 250mW; Temperature Coefficient: 100ppm/°C; Datasheet Link: https://www.nidec-copal-electronics.com/e/catalog/trimmer/st-4.pdf; Height: 2.6mm; Manufacturer_Part_Number: ST-4ETB203; Supplier 1: Digi-Key; Manufacturer: Nidec Copal; Manufacturer Part Number: ST4ETB203; RoHS: Yes; Category: Variable Resistors and Potentiometers; Stock 1: 792; Pricing 1: 1=1.20000, 10=1.06000, 25=0.95440, 50=0.91920, 100=0.88380, 250=0.83072 (USD); Mount: Surface Mount; Color: Black; Weight: 120mg; Min Operating Temperature: -55°C; Max Operating Temperature: 125°C; Termination: Gull Wing; Packaging: Tape and Reel; Resistor Type: Cermet; Series: ST4; Length: 0.197inch; Width: 0.177inch; Radiation Hardening: No; Lead Free: Lead Free; ComponentLink1URL: https://datasheet.ciiva.com/2157/st-4-2157765.pdf?src-supplier=Digi-Key; ComponentLink1Description: https://datasheet.ciiva.com/2157/st-4-2157765.pdf?src-supplier=Digi-Key; ComponentLink2URL: https://datasheet.ciiva.com/2157/st-4-2157766.pdf?src-supplier=Digi-Key; ComponentLink2Description: https://datasheet.ciiva.com/2157/st-4-2157766.pdf?src-supplier=Digi-Key; Supplier Part Number 1: ST4ETB203CT-ND